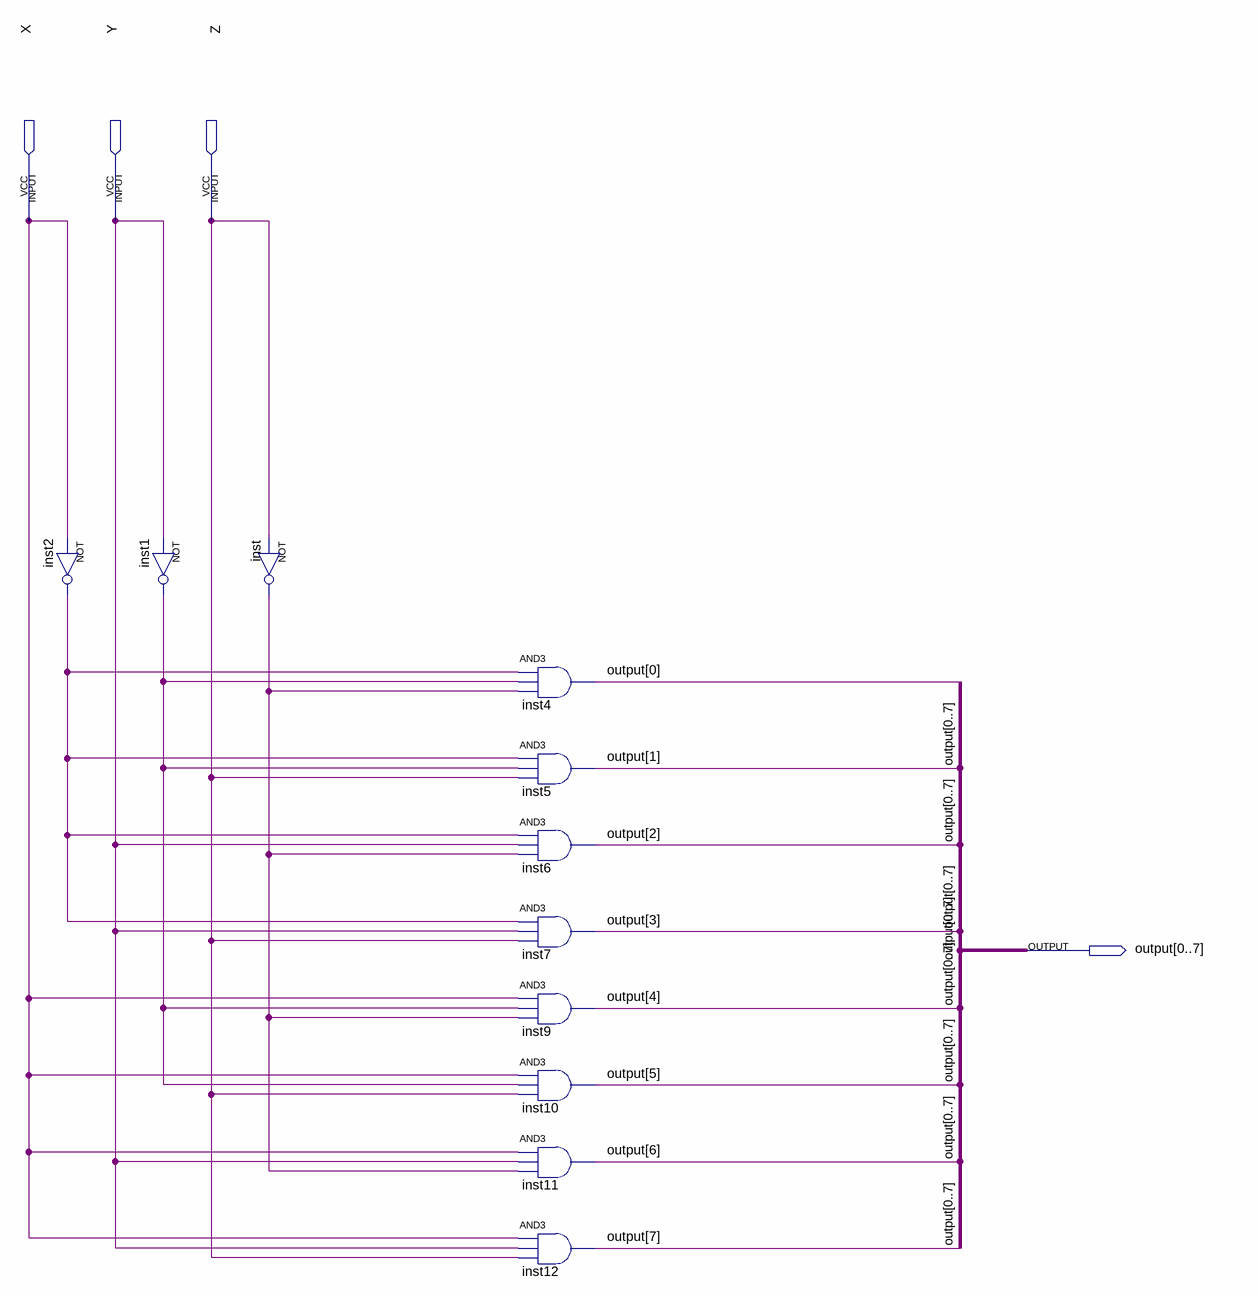
[diagram p0: schematic sheet]
// Quartus schematic 3-8Decoder.bdf as structural Verilog: 11 symbols, 4 pins
module \3-8Decoder  (
  input  X,
  input  Y,
  input  Z,
  output [0:7] \output 
);

  wire inst1_out, inst2_out, inst_out;

  not inst2 (inst2_out, X);
  not inst1 (inst1_out, Y);
  not inst (inst_out, Z);
  and inst4 (\output [0], inst2_out, inst1_out, inst_out);
  and inst5 (\output [1], inst2_out, inst1_out, Z);
  and inst6 (\output [2], inst2_out, Y, inst_out);
  and inst7 (\output [3], inst2_out, Y, Z);
  and inst9 (\output [4], X, inst1_out, inst_out);
  and inst10 (\output [5], X, inst1_out, Z);
  and inst11 (\output [6], X, Y, inst_out);
  and inst12 (\output [7], X, Y, Z);
endmodule
